# Altium schematic sheet schematic.SchDoc
size Letter
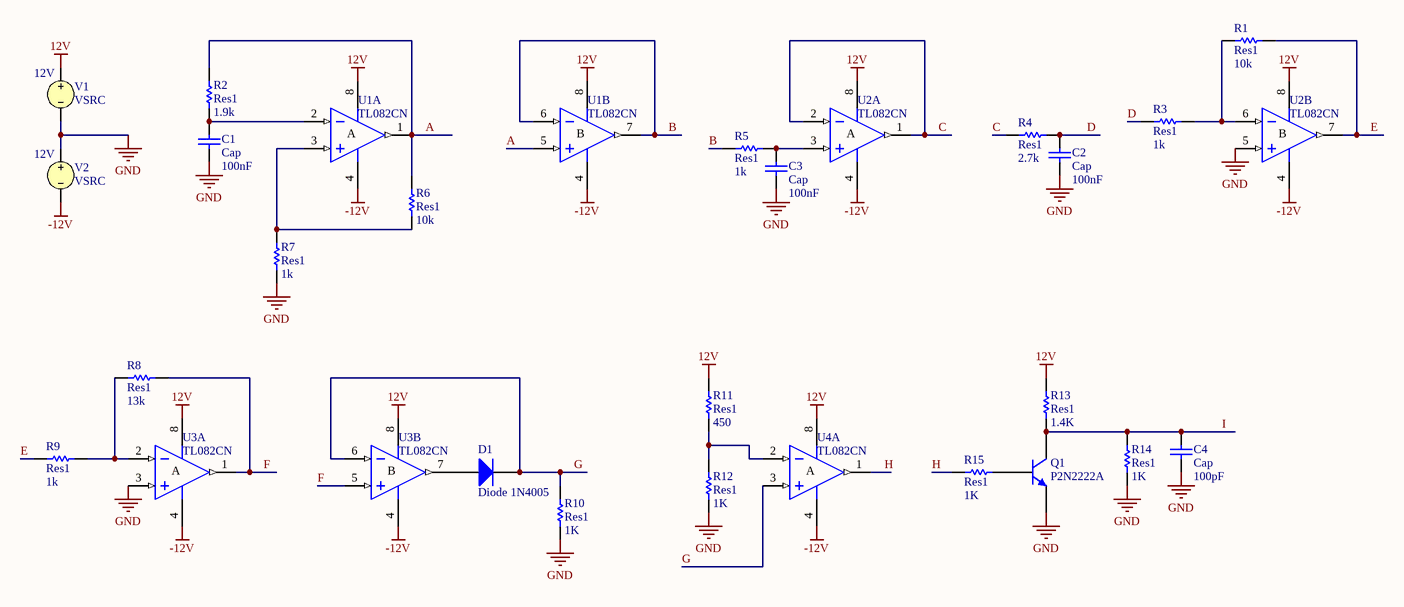
[diagram p0: schematic.SchDoc]

## Parts
C1  Cap  value 100nF  [RAD-0.3]
C2  Cap  value 100nF  [RAD-0.3]
C3  Cap  value 100nF  [RAD-0.3]
C4  Cap  value 100pF  [RAD-0.3]
D1  Diode 1N4005  [DO-41]
Q1  P2N2222A  [29-04]
R1  Res1  value 10k  [AXIAL-0.3]
R2  Res1  value 1.9k  [AXIAL-0.3]
R3  Res1  value 1k  [AXIAL-0.3]
R4  Res1  value 2.7k  [AXIAL-0.3]
R5  Res1  value 1k  [AXIAL-0.3]
R6  Res1  value 10k  [AXIAL-0.3]
R7  Res1  value 1k  [AXIAL-0.3]
R8  Res1  value 13k  [AXIAL-0.3]
R9  Res1  value 1k  [AXIAL-0.3]
R10  Res1  value 1K  [AXIAL-0.3]
R11  Res1  value 450  [AXIAL-0.3]
R12  Res1  value 1K  [AXIAL-0.3]
R13  Res1  value 1.4K  [AXIAL-0.3]
R14  Res1  value 1K  [AXIAL-0.3]
R15  Res1  value 1K  [AXIAL-0.3]
U1  TL082CN  [DIP8]  (parts A,B of 2)
U2  TL082CN  [DIP8]  (parts A,B of 2)
U3  TL082CN  [DIP8]  (parts A,B of 2)
U4  TL082CN  [DIP8]  (part A of 2)
V1  VSRC  value 12V
V2  VSRC  value 12V

## Nets
12V: R11.2 R13.2 U1.8(V+) U2.8(V+) U3.8(V+) U4.8(V+) V1.1
-12V: U1.4(V-) U2.4(V-) U3.4(V-) U4.4(V-) V2.2
GND: C1.1 C2.1 C3.1 C4.1 Q1.3(E) R7.1 R10.1 R12.1 R14.1 U2.5(IN+) U3.3(IN+) V1.2 V2.1
A: R2.2 R6.2 U1.1(OUT) U1.5(IN+)
B: R5.1 U1.6(IN-) U1.7(OUT)
C: R4.1 U2.1(OUT) U2.2(IN-)
D: C2.2 R3.1 R4.2
E: R1.2 R9.1 U2.7(OUT)
F: R8.2 U3.1(OUT) U3.5(IN+)
G: D1.2(K) R10.2 U3.6(IN-) U4.3(IN+)
H: R15.2 U4.1(OUT)
I: C4.2 Q1.1(C) R13.1 R14.2
NetC1_2: C1.2 R2.1 U1.2(IN-)
NetC3_2: C3.2 R5.2 U2.3(IN+)
NetD1_1: D1.1(A) U3.7(OUT)
NetQ1_2: Q1.2(B) R15.1
NetR1_1: R1.1 R3.2 U2.6(IN-)
NetR6_1: R6.1 R7.2 U1.3(IN+)
NetR8_1: R8.1 R9.2 U3.2(IN-)
NetR11_1: R11.1 R12.2 U4.2(IN-)

## Notes on the sheet
- (in symbol TL082CN, part A) A
- (in symbol TL082CN, part B) B

## Library data of the parts
C1-C4 = Cap: Capacitor; Published: 8-Jun-2000; LatestRevisionDate: 17-Jul-2002; LatestRevisionNote: Re-released for DXP Platform.; PackageReference: RAD-0.3; Publisher: Altium Limited; PackageDescription: Radial Cap, Thru-Hole; 2 Leads; 0.3 in Pin Spacing
D1 = Diode 1N4005: 1 Amp General Purpose Rectifier; Published: 8-Jun-2000; LatestRevisionDate: 17-Jul-2002; LatestRevisionNote: Re-released for DXP Platform.; DatasheetVersion: 1998; PackageVersion: Aug-1999; PackageReference: DO-41; Publisher: Altium Limited; PackageDescription: Diode, Axial; Body 5.2 x 2.7 mm (LxDia. max), Lead Dia. 0.86 mm (max); Code_JEDEC: DO-204-AL; ComponentLink1Description: Manufacturer Link; ComponentLink1URL: http://www.fairchildsemi.com/; ComponentLink2Description: Datasheet; ComponentLink2URL: http://www.fairchildsemi.com/ds/1N%2F1N4001.pdf
Q1 = P2N2222A: Amplifier Transistor NPN Silicon; Published: 29-Sep-2000; LatestRevisionDate: 17-Jul-2002; LatestRevisionNote: Re-released for DXP Platform.; DatasheetVersion: 1996; PackageVersion: 1996; PackageReference: 29-04; Publisher: Altium Limited; PackageDescription: TO, Flat Index; 3 In-Line, Axial Leads; Body Dia. 4.8mm; Leads 0.48 x 0.5 mm (max); ComponentLink1Description: Manufacturer Link; ComponentLink1URL: http://www.onsemi.com/site/products/landing?taxonomyID=194; ComponentLink2Description: Datasheet; ComponentLink2URL: http://www.onsemi.com/pub/Collateral/P2N2222A-D.PDF
R1-R15 = Res1: Resistor; Published: 8-Jun-2000; LatestRevisionDate: 17-Jul-2002; LatestRevisionNote: Re-released for DXP Platform.; PackageReference: AXIAL-0.3; Publisher: Altium Limited; PackageDescription: Axial Device, Thru-Hole; 2 Leads; 0.3 in Pin Spacing
U1-U4 = TL082CN: General-Purpose J-FET Dual Operational Amplifier; Published: 24-Aug-2001; LatestRevisionDate: 06-Jun-2005; LatestRevisionNote: Stylized 3D Model Added.; DatasheetVersion: Jan-1999; PackageReference: DIP8; Publisher: Altium Limited; PackageDescription: DIP; 8 Leads; Row Spacing 7.62 mm; Pitch 2.54 mm; Code_JEDEC: MO-001-AN; ComponentLink1Description: Manufacturer Link; ComponentLink1URL: http://www.st.com/; ComponentLink2Description: Datasheet; ComponentLink2URL: http://www.st.com/stonline/products/literature/ds/2300/tl082.pdf
V1 V2 = VSRC: Voltage Source; Note: PCB Footprint - Not required; Published: 8-Jun-2000; LatestRevisionDate: 17-Jul-2002; LatestRevisionNote: Re-released for DXP Platform.; PackageReference: Not Applicable; Publisher: Altium Limited